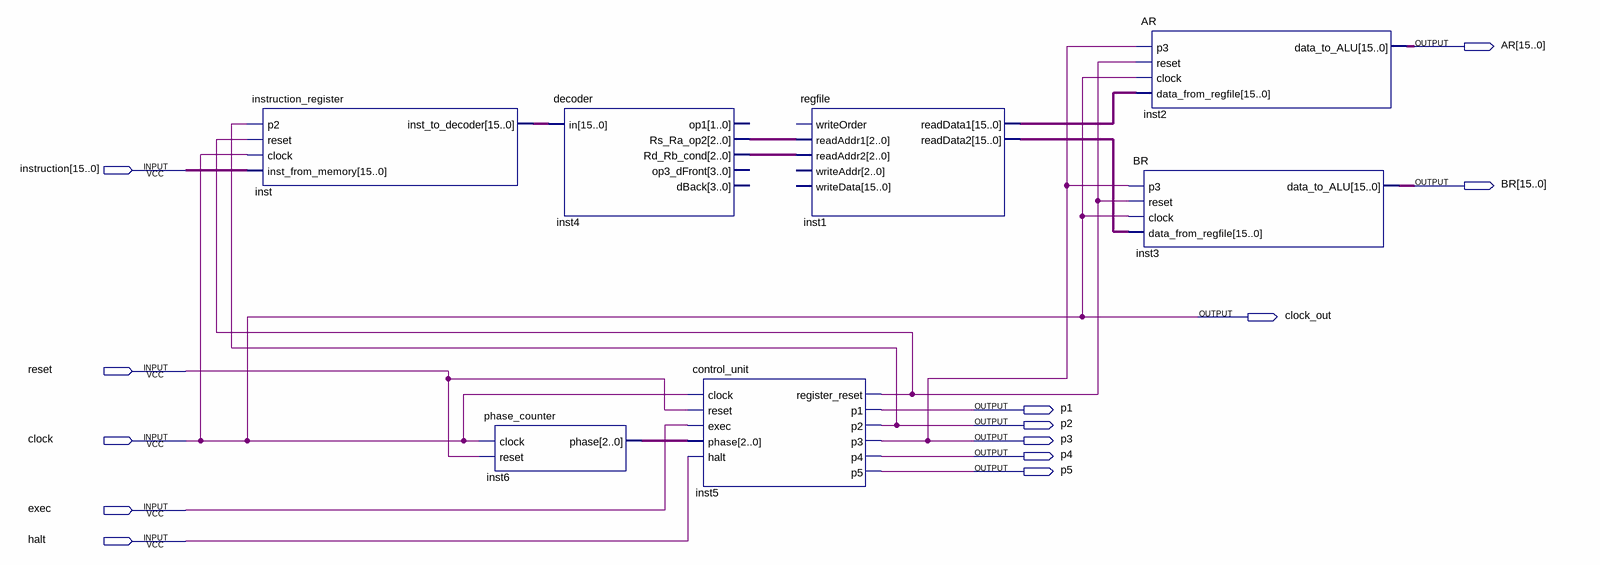
[diagram p0: schematic sheet]
// Quartus schematic processor_p2.bdf as structural Verilog: 7 symbols, 13 pins
module processor_p2 (
  input  [15:0] instruction,
  input  reset,
  input  clock,
  input  exec,
  input  halt,
  output [15:0] AR,
  output [15:0] BR,
  output clock_out,
  output p1,
  output p2,
  output p3,
  output p4,
  output p5
);

  wire inst5_register_reset;
  wire [2:0] inst4_rd_rb_cond, inst4_rs_ra_op2, inst6_phase;
  wire [15:0] inst1_readdata1, inst1_readdata2, inst_inst_to_decoder;

  instruction_register inst (
    .p2(p2), .reset(inst5_register_reset), .clock(clock), .inst_from_memory(instruction),
    .inst_to_decoder(inst_inst_to_decoder));
  phase_counter inst6 (.clock(clock), .reset(reset), .phase(inst6_phase));
  decoder inst4 (
    .in(inst_inst_to_decoder), .Rs_Ra_op2(inst4_rs_ra_op2), .Rd_Rb_cond(inst4_rd_rb_cond));  // open: op1, op3_dFront, dBack
  control_unit inst5 (
    .clock(clock), .reset(reset), .exec(exec), .phase(inst6_phase), .halt(halt),
    .register_reset(inst5_register_reset), .p1(p1), .p2(p2), .p3(p3), .p4(p4), .p5(p5));
  regfile inst1 (
    .readAddr1(inst4_rs_ra_op2), .readAddr2(inst4_rd_rb_cond), .readData1(inst1_readdata1),
    .readData2(inst1_readdata2));  // open: writeOrder, writeAddr, writeData
  AR inst2 (
    .p3(p3), .reset(inst5_register_reset), .clock(clock), .data_from_regfile(inst1_readdata1),
    .data_to_ALU(AR));
  BR inst3 (
    .p3(p3), .reset(inst5_register_reset), .clock(clock), .data_from_regfile(inst1_readdata2),
    .data_to_ALU(BR));

  assign clock_out = clock;
endmodule
